# Altium schematic sheet LDO-LM1117.SchDoc: LDO Regulator
size A4; Address3: Self Checkout Shopping Cart; DocumentNumber: 1; Revision: 1.0; SheetNumber: 4; SheetTotal: 7
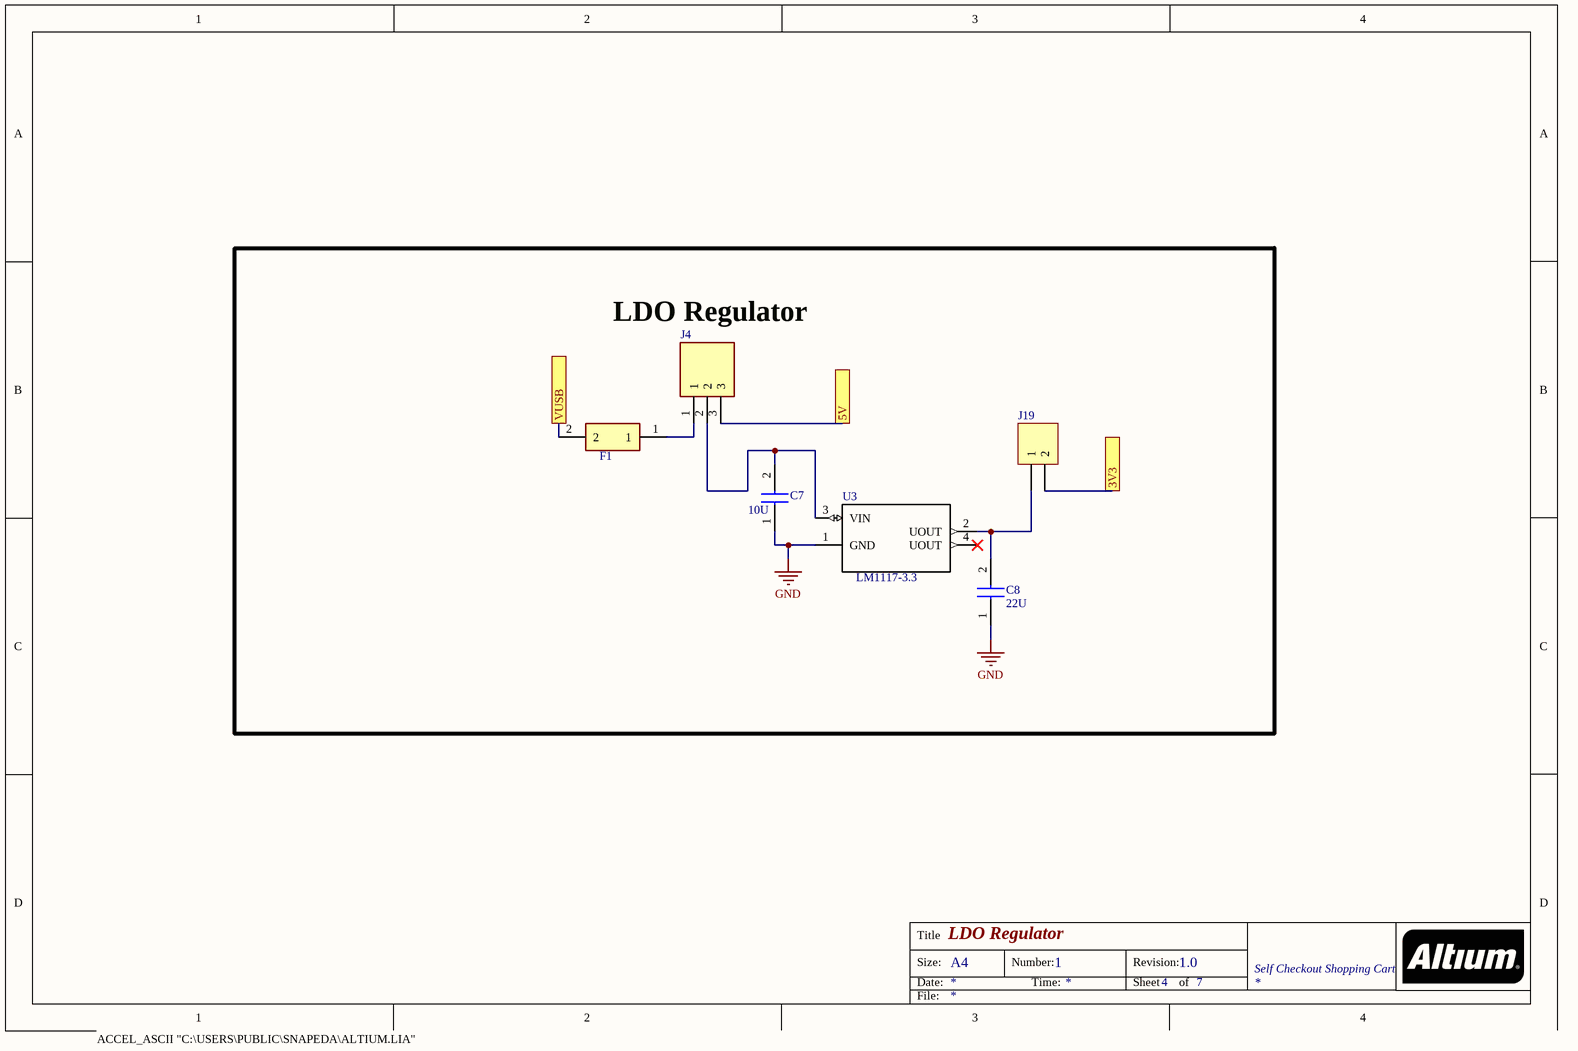
[diagram p0: LDO-LM1117.SchDoc]

## Parts
C7  value 10U  [CAPC6153X300N]  (hidden comment: KCM55LR71E156KH01K)
C8  value 22U  [CAPC3225X270N]  (hidden comment: GRM32ER71C226KEA8L)
F1  MF-MSMF050-2  [FUSC4632X85N]  (value not drawn)
J4  61900311121  [SHDR3W64P0X254_1X3_766X580X1175P]  (value not drawn)
J19  Header 2  [HDR1X2]  (value not drawn)
U3  LM1117-3.3  [*SOT-223]

## Blocks framed on the sheet
LDO Regulator: C7 C8 F1 J4 J19 U3

## Ports
3V3, 5V, VUSB

## Nets
GND: C7.1 C8.1 U3.1(GND)
3V3: J19.2 ; port 3V3
5V: J4.3 ; port 5V
VUSB: F1.2 ; port VUSB
NetC7_2: C7.2 J4.2 U3.3(VIN)
NetC8_2: C8.2 J19.1 U3.2(UOUT)
NetF1_1: F1.1 J4.1

Not connected (* = marked no-connect by the designer): U3 4(UOUT)*

## Notes on the sheet
- ACCEL_ASCII "C:\USERS\PUBLIC\SNAPEDA\ALTIUM.LIA"
  (asciiHeader
  (asciiVersion 5 0)
  (fileAuthor "(c) SnapEDA 2016 (snapeda.com)")
  (copyright "This work is licensed under a Creative Commons Attribution-ShareAlike 4.0 International License (CC BY-SA) with Design Exception 1.0")
  (fileUnits mm)
  )
  (library "Library"
  (padStyleDef "SSX45Y13"
  (holeDiam 0)
  (startRange 1)
  (endRange 2)
  (padShape (layerNumRef 1) (padShapeType Rect) (shapeWidth 0.45) (shapeHeight 1.38))
  (padShape (layerNumRef 2) (padShapeType Rect) (shapeWidth 0) (shapeHeight 0))
  (padShape (layerType Signal) (padShapeType Rect) (shapeWidth 0) (shapeHeight 0))
  (padShape (padShapeType Rect) (shapeWidth 0.45) (shapeHeight 1.38))
  (padShape (padShapeType Rect) (shapeWidth 0.45) (shapeHeight 1.38))
  (padShape (layerType Plane) (padShapeType NoConnect) (shapeWidth 0) (shapeHeight 0))
  (padShape (layerType NonSignal) (padShapeType Oval) (shapeWidth 0) (shapeHeight 0))
  )
  (padStyleDef "SSX14Y21"
  (holeDiam 0)
  (startRange 1)
  (endRange 2)
  (padShape (layerNumRef 1) (padShapeType Rect) (shapeWidth 1.4) (shapeHeight 2.1))
  (padShape (layerNumRef 2) (padShapeType Rect) (shapeWidth 0) (shapeHeight 0))
  (padShape (layerType Signal) (padShapeType Rect) (shapeWidth 0) (shapeHeight 0))
  (padShape (padShapeType Rect) (shapeWidth 1.4) (shapeHeight 2.1))
  (padShape (padShapeType Rect) (shapeWidth 1.4) (shapeHeight 2.1))
  (padShape (layerType Plane) (padShapeType NoConnect) (shapeWidth 0) (shapeHeight 0))
  (padShape (layerType NonSignal) (padShapeType Oval) (shapeWidth 0) (shapeHeight 0))
  )
  (padStyleDef "SSX13Y21"
  (holeDiam 0)
  (startRange 1)
  (endRange 2)
  (padShape (layerNumRef 1) (padShapeType Rect) (shapeWidth 1.375) (shapeHeight 2.1))
  (padShape (layerNumRef 2) (padShapeType Rect) (shapeWidth 0) (shapeHeight 0))
  (padShape (layerType Signal) (padShapeType Rect) (shapeWidth 0) (shapeHeight 0))
  (padShape (padShapeType Rect) (shapeWidth 1.375) (shapeHeight 2.1))
  (padShape (padShapeType Rect) (shapeWidth 1.375) (shapeHeight 2.1))
  (padShape (layerType Plane) (padShapeType NoConnect) (shapeWidth 0) (shapeHeight 0))
  (padShape (layerType NonSignal) (padShapeType Oval) (shapeWidth 0) (shapeHeight 0))
  )
  (padStyleDef "DUD60"
  (holeDiam 0.6)
  (isHolePlated False)
  (startRange 1)
  (endRange 2)
  (padShape (layerNumRef 1) (padShapeType Oval) (shapeWidth 0.6) (shapeHeight 0.6))
  (padShape (layerNumRef 2) (padShapeType Oval) (shapeWidth 0.6) (shapeHeight 0.6))
  (padShape (layerType Signal) (padShapeType Oval) (shapeWidth 0.6) (shapeHeight 0.6))
  (padShape (layerType Plane) (padShapeType NoConnect) (shapeWidth 0) (shapeHeight 0))
  (padShape (layerType NonSignal) (padShapeType Oval) (shapeWidth 0) (shapeHeight 0))
  )
  (padStyleDef "SSX10Y10"
  (holeDiam 0)
  (startRange 1)
  (endRange 2)
  (padShape (layerNumRef 1) (padShapeType Rect) (shapeWidth 0.1) (shapeHeight 0.1))
  (padShape (layerNumRef 2) (padShapeType Rect) (shapeWidth 0) (shapeHeight 0))
  (padShape (layerType Signal) (padShapeType Rect) (shapeWidth 0) (shapeHeight 0))
  (padShape (padShapeType Rect) (shapeWidth 0) (shapeHeight 0))
  (padShape (padShapeType Rect) (shapeWidth 0) (shapeHeight 0))
  (padShape (layerType Plane) (padShapeType NoConnect) (shapeWidth 0) (shapeHeight 0))
  (padShape (layerType NonSignal) (padShapeType Oval) (shapeWidth 0) (shapeHeight 0))
  )
  (textStyleDef "(Default)"
  (font
  (fontType Stroke)
  (fontFamily Modern)
  (fontFace "Quality")
  (fontHeight 3.54)
  )
  (textStyleAllowTType True)
  (textStyleDisplayTType False)
  )
  (textStyleDef "(PinStyle)"
  (font
  (fontType Stroke)
  (fontFamily SanSerif)
  (fontFace "QUALITY")
  (fontHeight 3.54)
  (strokeWidth 0.001)
  )
  (font
  (fontType TrueType)
  (fontFamily Modern)
  (fontFace "Times New Roman")
  (fontHeight 3.54)
  (strokeWidth 0.19843)
  (fontWeight 400)
  (fontCharSet 0)
  (fontOutPrecision 7)
  (fontClipPrecision 32)
  (fontQuality 1)
  (fontPitchAndFamily 6)
  )
  (textStyleAllowTType True)
  (textStyleDisplayTType False)
  )
  (textStyleDef "(LabelStyle)"
  (font
  (fontType Stroke)
  (fontFamily SanSerif)
  (fontFace "QUALITY")
  (fontHeight 3.54)
  (strokeWidth 0.001)
  )
  (font
  (fontType TrueType)
  (fontFamily Modern)
  (fontFace "Times New Roman")
  (fontHeight 3)
  (strokeWidth 0.19843)
  (fontWeight 400)
  (fontCharSet 0)
  (fontOutPrecision 7)
  (fontClipPrecision 32)
  (fontQuality 1)
  (fontPitchAndFamily 6)
  )
  (textStyleAllowTType True)
  (textStyleDisplayTType False)
  )
  (patternDefExtended "*TE_1932788-1"
  (originalName "*TE_1932788-1")
  (patternGraphicsNameRef "Primary")
  (patternGraphicsDef
  (patternGraphicsNameDef "Primary")
  (multiLayer
  (pad (padNum 3) (padStyleRef "SSX45Y13") (pt 0 0))
  (pad (padNum SH1) (padStyleRef "SSX14Y21") (pt -2.5 -0.36))
  (pad (padNum SH2) (padStyleRef "SSX14Y21") (pt 2.5 -0.36))
  (pad (padNum SH5) (padStyleRef "SSX13Y21") (pt -0.9375 -2.71))
  (pad (padNum 2) (padStyleRef "SSX45Y13") (pt -0.65 0))
  (pad (padNum 4) (padStyleRef "SSX45Y13") (pt 0.65 0))
  (pad (padNum 1) (padStyleRef "SSX45Y13") (pt -1.3 0))
  (pad (padNum 5) (padStyleRef "SSX45Y13") (pt 1.3 0))
  (pad (padNum SH4) (padStyleRef "SSX13Y21") (pt 0.9375 -2.71))
  (pad (padNum None) (padStyleRef "DUD60") (pt -3.95 -2.66))
  (pad (padNum None) (padStyleRef "DUD60") (pt 3.95 -2.66))
  (pad (padNum SH3) (padStyleRef "SSX10Y10") (pt 4 -3.5))
  (pad (padNum SH6) (padStyleRef "SSX10Y10") (pt -4 -3.5))
  )
  (layerContents (layerNumRef 1)
  (pcbPoly
  (pt 3.65 -2.66)
  (pt 3.65 -2.31)
  (pt 3.65 -2.30215)
  (pt 3.65082 -2.28646)
  (pt 3.65246 -2.27083)
  (pt 3.65492 -2.25531)
  (pt 3.65819 -2.23994)
  (pt 3.66226 -2.22477)
  (pt 3.66711 -2.20983)
  (pt 3.67274 -2.19516)
  (pt 3.67913 -2.1808)
  (pt 3.68626 -2.1668)
  (pt 3.69412 -2.1532)
  (pt 3.70268 -2.14002)
  (pt 3.71191 -2.12731)
  (pt 3.7218 -2.1151)
  (pt 3.73231 -2.10342)
  (pt 3.74342 -2.09231)
  (pt 3.7551 -2.0818)
  (pt 3.76731 -2.07191)
  (pt 3.78002 -2.06268)
  (pt 3.7932 -2.05412)
  (pt 3.8068 -2.04627)
  (pt 3.8208 -2.03913)
  (pt 3.83515 -2.03274)
  (pt 3.84982 -2.02711)
  (pt 3.86476 -2.02226)
  (pt 3.87994 -2.01819)
  (pt 3.89531 -2.01492)
  (pt 3.91083 -2.01246)
  (pt 3.92645 -2.01082)
  (pt 3.94214 -2.01)
  (pt 3.95 -2.01)
  (pt 3.95785 -2.01)
  (pt 3.97354 -2.01082)
  (pt 3.98917 -2.01246)
  (pt 4.00469 -2.01492)
  (pt 4.02006 -2.01819)
  (pt 4.03523 -2.02226)
  (pt 4.05017 -2.02711)
  (pt 4.06484 -2.03274)
  (pt 4.0792 -2.03913)
  (pt 4.0932 -2.04626)
  (pt 4.1068 -2.05412)
  (pt 4.11998 -2.06268)
  (pt 4.13269 -2.07191)
  (pt 4.1449 -2.0818)
  (pt 4.15658 -2.09231)
  (pt 4.16769 -2.10342)
  (pt 4.1782 -2.1151)
  (pt 4.18809 -2.12731)
  (pt 4.19732 -2.14002)
  (pt 4.20588 -2.1532)
  (pt 4.21373 -2.1668)
  (pt 4.22087 -2.1808)
  (pt 4.22726 -2.19515)
  (pt 4.23289 -2.20982)
  (pt 4.23774 -2.22476)
  (pt 4.24181 -2.23994)
  (pt 4.24508 -2.25531)
  (pt 4.24754 -2.27083)
  (pt 4.24918 -2.28645)
  (pt 4.25 -2.30214)
  (pt 4.25 -2.31)
  (pt 4.25 -3.01)
  (pt 4.25 -3.01785)
  (pt 4.24918 -3.03354)
  (pt 4.24754 -3.04917)
  (pt 4.24508 -3.06469)
  (pt 4.24181 -3.08006)
  (pt 4.23774 -3.09523)
  (pt 4.23289 -3.11017)
  (pt 4.22726 -3.12484)
  (pt 4.22087 -3.1392)
  (pt 4.21374 -3.1532)
  (pt 4.20588 -3.1668)
  (pt 4.19732 -3.17998)
  (pt 4.18809 -3.19269)
  (pt 4.1782 -3.2049)
  (pt 4.16769 -3.21658)
  (pt 4.15658 -3.22769)
  (pt 4.1449 -3.2382)
  (pt 4.13269 -3.24809)
  (pt 4.11998 -3.25732)
  (pt 4.1068 -3.26588)
  (pt 4.0932 -3.27373)
  (pt 4.0792 -3.28087)
  (pt 4.06485 -3.28726)
  (pt 4.05018 -3.29289)
  (pt 4.03524 -3.29774)
  (pt 4.02006 -3.30181)
  (pt 4.00469 -3.30508)
  (pt 3.98917 -3.30754)
  (pt 3.97355 -3.30918)
  (pt 3.95786 -3.31)
  (pt 3.95 -3.31)
  (pt 3.94215 -3.31)
  (pt 3.92646 -3.30918)
  (pt 3.91083 -3.30754)
  (pt 3.89531 -3.30508)
  (pt 3.87994 -3.30181)
  (pt 3.86477 -3.29774)
  (pt 3.84983 -3.29289)
  (pt 3.83516 -3.28726)
  (pt 3.8208 -3.28087)
  (pt 3.8068 -3.27374)
  (pt 3.7932 -3.26588)
  (pt 3.78002 -3.25732)
  (pt 3.76731 -3.24809)
  (pt 3.7551 -3.2382)
  (pt 3.74342 -3.22769)
  (pt 3.73231 -3.21658)
  (pt 3.7218 -3.2049)
  (pt 3.71191 -3.19269)
  (pt 3.70268 -3.17998)
  (pt 3.69412 -3.1668)
  (pt 3.68627 -3.1532)
  (pt 3.67913 -3.1392)
  (pt 3.67274 -3.12485)
  (pt 3.66711 -3.11018)
  (pt 3.66226 -3.09524)
  (pt 3.65819 -3.08006)
  (pt 3.65492 -3.06469)
  (pt 3.65246 -3.04917)
  (pt 3.65082 -3.03355)
  (pt 3.65 -3.01786)
  (pt 3.65 -3.01)
  (pt 3.65 -2.66)
  (pt 3.25 -2.66)
  (pt 3.25 -3.01)
  (pt 3.25 -3.02833)
  (pt 3.25192 -3.06494)
  (pt 3.25575 -3.1014)
  (pt 3.26148 -3.1376)
  (pt 3.26911 -3.17346)
  (pt 3.2786 -3.20887)
  (pt 3.28992 -3.24374)
  (pt 3.30306 -3.27797)
  (pt 3.31797 -3.31146)
  (pt 3.33462 -3.34412)
  (pt 3.35295 -3.37587)
  (pt 3.37291 -3.40662)
  (pt 3.39446 -3.43628)
  (pt 3.41753 -3.46477)
  (pt 3.44206 -3.49201)
  (pt 3.46798 -3.51793)
  (pt 3.49523 -3.54246)
  (pt 3.52372 -3.56554)
  (pt 3.55338 -3.58708)
  (pt 3.58412 -3.60705)
  (pt 3.61587 -3.62538)
  (pt 3.64854 -3.64202)
  (pt 3.68203 -3.65694)
  (pt 3.71625 -3.67007)
  (pt 3.75112 -3.6814)
  (pt 3.78653 -3.69089)
  (pt 3.82239 -3.69851)
  (pt 3.8586 -3.70425)
  (pt 3.89506 -3.70808)
  (pt 3.93167 -3.71)
  (pt 3.95 -3.71)
  (pt 3.96833 -3.71)
  (pt 4.00494 -3.70808)
  (pt 4.0414 -3.70425)
  (pt 4.0776 -3.69852)
  (pt 4.11346 -3.69089)
  (pt 4.14887 -3.6814)
  (pt 4.18374 -3.67008)
  (pt 4.21797 -3.65694)
  (pt 4.25146 -3.64203)
  (pt 4.28412 -3.62538)
  (pt 4.31587 -3.60705)
  (pt 4.34662 -3.58709)
  (pt 4.37628 -3.56554)
  (pt 4.40477 -3.54247)
  (pt 4.43201 -3.51794)
  (pt 4.45793 -3.49202)
  (pt 4.48246 -3.46477)
  (pt 4.50554 -3.43628)
  (pt 4.52708 -3.40662)
  (pt 4.54705 -3.37588)
  (pt 4.56538 -3.34413)
  (pt 4.58202 -3.31146)
  (pt 4.59694 -3.27797)
  (pt 4.61007 -3.24375)
  (pt 4.6214 -3.20888)
  (pt 4.63089 -3.17347)
  (pt 4.63851 -3.13761)
  (pt 4.64425 -3.1014)
  (pt 4.64808 -3.06494)
  (pt 4.65 -3.02833)
  (pt 4.65 -3.01)
  (pt 4.65 -2.31)
  (pt 4.65 -2.29167)
  (pt 4.64808 -2.25506)
  (pt 4.64425 -2.2186)
  (pt 4.63852 -2.1824)
  (pt 4.63089 -2.14654)
  (pt 4.6214 -2.11113)
  (pt 4.61008 -2.07626)
  (pt 4.59694 -2.04203)
  (pt 4.58203 -2.00854)
  (pt 4.56538 -1.97588)
  (pt 4.54705 -1.94413)
  (pt 4.52709 -1.91338)
  (pt 4.50554 -1.88372)
  (pt 4.48247 -1.85523)
  (pt 4.45794 -1.82799)
  (pt 4.43202 -1.80207)
  (pt 4.40477 -1.77754)
  (pt 4.37628 -1.75446)
  (pt 4.34662 -1.73292)
  (pt 4.31588 -1.71295)
  (pt 4.28413 -1.69462)
  (pt 4.25146 -1.67798)
  (pt 4.21797 -1.66306)
  (pt 4.18375 -1.64993)
  (pt 4.14888 -1.6386)
  (pt 4.11347 -1.62911)
  (pt 4.07761 -1.62149)
  (pt 4.0414 -1.61575)
  (pt 4.00494 -1.61192)
  (pt 3.96833 -1.61)
  (pt 3.95 -1.61)
  (pt 3.93167 -1.61)
  (pt 3.89506 -1.61192)
  (pt 3.8586 -1.61575)
  (pt 3.8224 -1.62148)
  (pt 3.78654 -1.62911)
  (pt 3.75113 -1.6386)
  (pt 3.71626 -1.64992)
  (pt 3.68203 -1.66306)
  (pt 3.64854 -1.67797)
  (pt 3.61588 -1.69462)
  (pt 3.58413 -1.71295)
  (pt 3.55338 -1.73291)
  (pt 3.52372 -1.75446)
  (pt 3.49523 -1.77753)
  (pt 3.46799 -1.80206)
  (pt 3.44207 -1.82798)
  (pt 3.41754 -1.85523)
  (pt 3.39446 -1.88372)
  (pt 3.37292 -1.91338)
  (pt 3.35295 -1.94412)
  (pt 3.33462 -1.97587)
  (pt 3.31798 -2.00854)
  (pt 3.30306 -2.04203)
  (pt 3.28993 -2.07625)
  (pt 3.2786 -2.11112)
  (pt 3.26911 -2.14653)
  (pt 3.26149 -2.18239)
  (pt 3.25575 -2.2186)
  (pt 3.25192 -2.25506)
  (pt 3.25 -2.29167)
  (pt 3.25 -2.31)
  (pt 3.25 -2.66)
  (pt 3.65 -2.66)
  )
  (pcbPoly
  (pt -4.25 -2.66)
  (pt -4.25 -2.31)
  (pt -4.25 -2.30215)
  (pt -4.24918 -2.28646)
  (pt -4.24754 -2.27083)
  (pt -4.24508 -2.25531)
  (pt -4.24181 -2.23994)
  (pt -4.23774 -2.22477)
  (pt -4.23289 -2.20983)
  (pt -4.22726 -2.19516)
  (pt -4.22087 -2.1808)
  (pt -4.21374 -2.1668)
  (pt -4.20588 -2.1532)
  (pt -4.19732 -2.14002)
  (pt -4.18809 -2.12731)
  (pt -4.1782 -2.1151)
  (pt -4.16769 -2.10342)
  (pt -4.15658 -2.09231)
  (pt -4.1449 -2.0818)
  (pt -4.13269 -2.07191)
  (pt -4.11998 -2.06268)
  (pt -4.1068 -2.05412)
  (pt -4.0932 -2.04627)
  (pt -4.0792 -2.03913)
  (pt -4.06485 -2.03274)
  (pt -4.05018 -2.02711)
  (pt -4.03524 -2.02226)
  (pt -4.02006 -2.01819)
  (pt -4.00469 -2.01492)
  (pt -3.98917 -2.01246)
  (pt -3.97355 -2.01082)
  (pt -3.95786 -2.01)
  (pt -3.95 -2.01)
  (pt -3.94215 -2.01)
  (pt -3.92646 -2.01082)
  (pt -3.91083 -2.01246)
  (pt -3.89531 -2.01492)
  (pt -3.87994 -2.01819)
  (pt -3.86477 -2.02226)
  (pt -3.84983 -2.02711)
  (pt -3.83516 -2.03274)
  (pt -3.8208 -2.03913)
  (pt -3.8068 -2.04626)
  (pt -3.7932 -2.05412)
  (pt -3.78002 -2.06268)
  (pt -3.76731 -2.07191)
  (pt -3.7551 -2.0818)
  (pt -3.74342 -2.09231)
  (pt -3.73231 -2.10342)
  (pt -3.7218 -2.1151)
  (pt -3.71191 -2.12731)
  (pt -3.70268 -2.14002)
  (pt -3.69412 -2.1532)
  (pt -3.68627 -2.1668)
  (pt -3.67913 -2.1808)
  (pt -3.67274 -2.19515)
  (pt -3.66711 -2.20982)
  (pt -3.66226 -2.22476)
  (pt -3.65819 -2.23994)
  (pt -3.65492 -2.25531)
  (pt -3.65246 -2.27083)
  (pt -3.65082 -2.28645)
  (pt -3.65 -2.30214)
  (pt -3.65 -2.31)
  (pt -3.65 -3.01)
  (pt -3.65 -3.01785)
  (pt -3.65082 -3.03354)
  (pt -3.65246 -3.04917)
  (pt -3.65492 -3.06469)
  (pt -3.65819 -3.08006)
  (pt -3.66226 -3.09523)
  (pt -3.66711 -3.11017)
  (pt -3.67274 -3.12484)
  (pt -3.67913 -3.1392)
  (pt -3.68626 -3.1532)
  (pt -3.69412 -3.1668)
  (pt -3.70268 -3.17998)
  (pt -3.71191 -3.19269)
  (pt -3.7218 -3.2049)
  (pt -3.73231 -3.21658)
  (pt -3.74342 -3.22769)
  (pt -3.7551 -3.2382)
  (pt -3.76731 -3.24809)
  (pt -3.78002 -3.25732)
  (pt -3.7932 -3.26588)
  (pt -3.8068 -3.27373)
  (pt -3.8208 -3.28087)
  (pt -3.83515 -3.28726)
  (pt -3.84982 -3.29289)
  (pt -3.86476 -3.29774)
  (pt -3.87994 -3.30181)
  (pt -3.89531 -3.30508)
  (pt -3.91083 -3.30754)
  (pt -3.92645 -3.30918)
  (pt -3.94214 -3.31)
  (pt -3.95 -3.31)
  (pt -3.95785 -3.31)
  (pt -3.97354 -3.30918)
  (pt -3.98917 -3.30754)
  (pt -4.00469 -3.30508)
  (pt -4.02006 -3.30181)
  (pt -4.03523 -3.29774)
  (pt -4.05017 -3.29289)
  (pt -4.06484 -3.28726)
  (pt -4.0792 -3.28087)
  (pt -4.0932 -3.27374)
  (pt -4.1068 -3.26588)
  (pt -4.11998 -3.25732)
  (pt -4.13269 -3.24809)
  (pt -4.1449 -3.2382)
  (pt -4.15658 -3.22769)
  (pt -4.16769 -3.21658)
  (pt -4.1782 -3.2049)
  (pt -4.18809 -3.19269)
  (pt -4.19732 -3.17998)
  (pt -4.20588 -3.1668)
  (pt -4.21373 -3.1532)
  (pt -4.22087 -3.1392)
  (pt -4.22726 -3.12485)
  (pt -4.23289 -3.11018)
  (pt -4.23774 -3.09524)
  (pt -4.24181 -3.08006)
  (pt -4.24508 -3.06469)
  (pt -4.24754 -3.04917)
  (pt -4.24918 -3.03355)
  (pt -4.25 -3.01786)
  (pt -4.25 -3.01)
  (pt -4.25 -2.66)
  (pt -4.65 -2.66)
  (pt -4.65 -3.01)
  (pt -4.65 -3.02833)
  (pt -4.64808 -3.06494)
  (pt -4.64425 -3.1014)
  (pt -4.63852 -3.1376)
  (pt -4.63089 -3.17346)
  (pt -4.6214 -3.20887)
  (pt -4.61008 -3.24374)
  (pt -4.59694 -3.27797)
  (pt -4.58203 -3.31146)
  (pt -4.56538 -3.34412)
  (pt -4.54705 -3.37587)
  (pt -4.52709 -3.40662)
  (pt -4.50554 -3.43628)
  (pt -4.48247 -3.46477)
  (pt -4.45794 -3.49201)
  (pt -4.43202 -3.51793)
  (pt -4.40477 -3.54246)
  (pt -4.37628 -3.56554)
  (pt -4.34662 -3.58708)
  (pt -4.31588 -3.60705)
  (pt -4.28413 -3.62538)
  (pt -4.25146 -3.64202)
  (pt -4.21797 -3.65694)
  (pt -4.18375 -3.67007)
  (pt -4.14888 -3.6814)
  (pt -4.11347 -3.69089)
  (pt -4.07761 -3.69851)
  (pt -4.0414 -3.70425)
  (pt -4.00494 -3.70808)
  (pt -3.96833 -3.71)
  (pt -3.95 -3.71)
  (pt -3.93167 -3.71)
  (pt -3.89506 -3.70808)
  (pt -3.8586 -3.70425)
  (pt -3.8224 -3.69852)
  (pt -3.78654 -3.69089)
  (pt -3.75113 -3.6814)
  (pt -3.71626 -3.67008)
  (pt -3.68203 -3.65694)
  (pt -3.64854 -3.64203)
  (pt -3.61588 -3.62538)
  (pt -3.58413 -3.60705)
  (pt -3.55338 -3.58709)
  (pt -3.52372 -3.56554)
  (pt -3.49523 -3.54247)
  (pt -3.46799 -3.51794)
  (pt -3.44207 -3.49202)
  (pt -3.41754 -3.46477)
  (pt -3.39446 -3.43628)
  (pt -3.37292 -3.40662)
  (pt -3.35295 -3.37588)
  (pt -3.33462 -3.34413)
  (pt -3.31798 -3.31146)
  (pt -3.30306 -3.27797)
  (pt -3.28993 -3.24375)
  (pt -3.2786 -3.20888)
  (pt -3.26911 -3.17347)
  (pt -3.26149 -3.13761)
  (pt -3.25575 -3.1014)
  (pt -3.25192 -3.06494)
  (pt -3.25 -3.02833)
  (pt -3.25 -3.01)
  (pt -3.25 -2.31)
  (pt -3.25 -2.29167)
  (pt -3.25192 -2.25506)
  (pt -3.25575 -2.2186)
  (pt -3.26148 -2.1824)
  (pt -3.26911 -2.14654)
  (pt -3.2786 -2.11113)
  (pt -3.28992 -2.07626)
  (pt -3.30306 -2.04203)
  (pt -3.31797 -2.00854)
  (pt -3.33462 -1.97588)
  (pt -3.35295 -1.94413)
  (pt -3.37291 -1.91338)
  (pt -3.39446 -1.88372)
  (pt -3.41753 -1.85523)
  (pt -3.44206 -1.82799)
  (pt -3.46798 -1.80207)
  (pt -3.49523 -1.77754)
  (pt -3.52372 -1.75446)
  (pt -3.55338 -1.73292)
  (pt -3.58412 -1.71295)
  (pt -3.61587 -1.69462)
  (pt -3.64854 -1.67798)
  (pt -3.68203 -1.66306)
  (pt -3.71625 -1.64993)
  (pt -3.75112 -1.6386)
  (pt -3.78653 -1.62911)
  (pt -3.82239 -1.62149)
  (pt -3.8586 -1.61575)
  (pt -3.89506 -1.61192)
  (pt -3.93167 -1.61)
  (pt -3.95 -1.61)
  (pt -3.96833 -1.61)
  (pt -4.00494 -1.61192)
  (pt -4.0414 -1.61575)
  (pt -4.0776 -1.62148)
  (pt -4.11346 -1.62911)
  (pt -4.14887 -1.6386)
  (pt -4.18374 -1.64992)
  (pt -4.21797 -1.66306)
  (pt -4.25146 -1.67797)
  (pt -4.28412 -1.69462)
  (pt -4.31587 -1.71295)
  (pt -4.34662 -1.73291)
  (pt -4.37628 -1.75446)
  (pt -4.40477 -1.77753)
  (pt -4.43201 -1.80206)
  (pt -4.45793 -1.82798)
  (pt -4.48246 -1.85523)
  (pt -4.50554 -1.88372)
  (pt -4.52708 -1.91338)
  (pt -4.54705 -1.94412)
  (pt -4.56538 -1.97587)
  (pt -4.58202 -2.00854)
  (pt -4.59694 -2.04203)
  (pt -4.61007 -2.07625)
  (pt -4.6214 -2.11112)
  (pt -4.63089 -2.14653)
  (pt -4.63851 -2.18239)
  (pt -4.64425 -2.2186)
  (pt -4.64808 -2.25506)
  (pt -4.65 -2.29167)
  (pt -4.65 -2.31)
  (pt -4.65 -2.66)
  (pt -4.25 -2.66)
  )
  )
  (layerContents (layerNumRef 20)
  (line (pt -3.76 0.34) (pt 3.76 0.34) (width 0.127))
  (line (pt 3.76 0.34) (pt 3.76 -4.11) (width 0.127))
  (line (pt 3.76 -4.11) (pt 3.76 -4.81) (width 0.127))
  (line (pt 3.76 -4.81) (pt -3.76 -4.81) (width 0.127))
  (line (pt -3.76 -4.81) (pt -3.76 -4.11) (width 0.127))
  (line (pt -3.76 -4.11) (pt -3.76 0.34) (width 0.127))
  (attr "RefDes" "" (pt -5.00279 1.59089) (justify LowerLeft) (isVisible True) (textStyleRef "(PinStyle)"))
  (attr "Type" "" (pt -5.30911 -6.81169) (justify LowerLeft) (isVisible True) (textStyleRef "(PinStyle)"))
  (text (pt 0.490973 -4.32808) "PCB EDGE" (justify LowerLeft) (isVisible True) (textStyleRef "(LabelStyle)"))
  (line (pt -3.76 -4.11) (pt 3.76 -4.11) (width 0.127))
  (arc (pt -1.3 0) (radius 0.1) (startAngle 0) (sweepAngle 360) (width 0.2))
  )
  (layerContents (layerNumRef 20)
  (line (pt -3.76 0.34) (pt 3.76 0.34) (width 0.127))
  (line (pt 3.76 0.34) (pt 3.76 -4.11) (width 0.127))
  (line (pt 3.76 -4.11) (pt 3.76 -4.81) (width 0.127))
  (line (pt 3.76 -4.81) (pt -3.76 -4.81) (width 0.127))
  (line (pt -3.76 -4.81) (pt -3.76 -4.11) (width 0.127))
  (line (pt -3.76 -4.11) (pt -3.76 0.34) (width 0.127))
  (attr "RefDes" "" (pt -5.00279 1.59089) (justify LowerLeft) (isVisible True) (textStyleRef "(PinStyle)"))
  (attr "Type" "" (pt -5.30911 -6.81169) (justify LowerLeft) (isVisible True) (textStyleRef "(PinStyle)"))
  (text (pt 0.490973 -4.32808) "PCB EDGE" (justify LowerLeft) (isVisible True) (textStyleRef "(LabelStyle)"))
  (line (pt -3.76 -4.11) (pt 3.76 -4.11) (width 0.127))
  (arc (pt -1.3 0) (radius 0.1) (startAngle 0) (sweepAngle 360) (width 0.2))
  )
  (layerContents (layerNumRef 10)
  (line (pt -4.7 -4.11) (pt -3.3 -4.11) (width 0.0001))
  (line (pt -3.3 -4.11) (pt -2.825 -3.61) (width 0.0001))
  (line (pt -2.825 -3.61) (pt -2.825 -2.51) (width 0.0001))
  (arc (pt -2.3875 -2.4975) (radius 0.437679) (startAngle 92) (sweepAngle 90) (width 0.0001))
  (arc (pt -2.3875 -2.5225) (radius 0.462669) (startAngle 2) (sweepAngle 90) (width 0.0001))
  (line (pt -1.925 -2.51) (pt -1.925 -3.61) (width 0.0001))
  (line (pt -1.925 -3.61) (pt -1.5 -4.11) (width 0.0001))
  (line (pt -1.5 -4.11) (pt 1.5 -4.11) (width 0.0001))
  (line (pt 1.5 -4.11) (pt 1.925 -3.61) (width 0.0001))
  (line (pt 1.925 -3.61) (pt 1.925 -2.51) (width 0.0001))
  (arc (pt 2.3875 -2.5225) (radius 0.462669) (startAngle 88) (sweepAngle 90) (width 0.0001))
  (arc (pt 2.3875 -2.4975) (radius 0.437679) (startAngle 358) (sweepAngle -270) (width 0.0001))
  (line (pt 2.825 -2.51) (pt 2.825 -3.61) (width 0.0001))
  (line (pt 2.825 -3.61) (pt 3.3 -4.11) (width 0.0001))
  (line (pt 3.3 -4.11) (pt 4.9 -4.11) (width 0.0001))
  (arc (pt 3.95 -2.31) (radius 0.3) (startAngle 0) (sweepAngle 90) (width 0.0001))
  (arc (pt 3.95 -2.31) (radius 0.3) (startAngle 90) (sweepAngle 90) (width 0.0001))
  (line (pt 3.65 -2.31) (pt 3.65 -3.01) (width 0.0001))
  (arc (pt 3.95 -3.01) (radius 0.3) (startAngle 180) (sweepAngle 90) (width 0.0001))
  (arc (pt 3.95 -3.01) (radius 0.3) (startAngle 270) (sweepAngle -270) (width 0.0001))
  (line (pt 4.25 -3.01) (pt 4.25 -2.31) (width 0.0001))
  (arc (pt -3.95 -2.31) (radius 0.3) (startAngle 0) (sweepAngle 90) (width 0.0001))
  (arc (pt -3.95 -2.31) (radius 0.3) (startAngle 90) (sweepAngle 90) (width 0.0001))
  (line (pt -4.25 -2.31) (pt -4.25 -3.01) (width 0.0001))
  (arc (pt -3.95 -3.01) (radius 0.3) (startAngle 180) (sweepAngle 90) (width 0.0001))
  (arc (pt -3.95 -3.01) (radius 0.3) (startAngle 270) (sweepAngle -270) (width 0.0001))
  (line (pt -3.65 -3.01) (pt -3.65 -2.31) (width 0.0001))
  )
  (layerContents (layerNumRef 6)
  (line (pt -3.76 -3.96) (pt -3.76 -4.81) (width 0.127))
  (line (pt -3.76 -4.81) (pt 3.76 -4.81) (width 0.127))
  (line (pt 3.76 -4.81) (pt 3.76 -3.96) (width 0.127))
  (line (pt -3.76 -1.36) (pt -3.76 0.34) (width 0.127))
  (line (pt -3.76 0.34) (pt -3.4 0.34) (width 0.127))
  (line (pt 3.4 0.34) (pt 3.76 0.34) (width 0.127))
  (line (pt 3.76 0.34) (pt 3.76 -1.36) (width 0.127))
  (arc (pt -1.3 1.25) (radius 0.1) (startAngle 0) (sweepAngle 360) (width 0.2))
  )
  (layerContents (layerNumRef 5)
  (pcbPoly
  (pt 3.65 -2.66)
  (pt 3.65 -2.31)
  (pt 3.65 -2.30215)
  (pt 3.65082 -2.28646)
  (pt 3.65246 -2.27083)
  (pt 3.65492 -2.25531)
  (pt 3.65819 -2.23994)
  (pt 3.66226 -2.22477)
  (pt 3.66711 -2.20983)
  (pt 3.67274 -2.19516)
  (pt 3.67913 -2.1808)
  (pt 3.68626 -2.1668)
  (pt 3.69412 -2.1532)
  (pt 3.70268 -2.14002)
  (pt 3.71191 -2.12731)
  (pt 3.7218 -2.1151)
  (pt 3.73231 -2.10342)
  (pt 3.74342 -2.09231)
  (pt 3.7551 -2.0818)
  (pt 3.76731 -2.07191)
  (pt 3.78002 -2.06268)
  (pt 3.7932 -2.05412)
  (pt 3.8068 -2.04627)
  (pt 3.8208 -2.03913)
  (pt 3.83515 -2.03274)
  (pt 3.84982 -2.02711)
  (pt 3.86476 -2.02226)
  (pt 3.87994 -2.01819)
  (pt 3.89531 -2.01492)
  (pt 3.91083 -2.01246)
  (pt 3.92645 -2.01082)
  (pt 3.94214 -2.01)
  (pt 3.95 -2.01)
  (pt 3.95785 -2.01)
  (pt 3.97354 -2.01082)
  (pt 3.98917 -2.01246)
  (pt 4.00469 -2.01492)
  (pt 4.02006 -2.01819)
  (pt 4.03523 -2.02226)
  (pt 4.05017 -2.02711)
  (pt 4.06484 -2.03274)
  (pt 4.0792 -2.03913)
  (pt 4.0932 -2.04626)
  (pt 4.1068 -2.05412)
  (pt 4.11998 -2.06268)
  (pt 4.13269 -2.07191)
  (pt 4.1449 -2.0818)
  (pt 4.15658 -2.09231)
  (pt 4.16769 -2.10342)
  (pt 4.1782 -2.1151)
  (pt 4.18809 -2.12731)
  (pt 4.19732 -2.14002)
  (pt 4.20588 -2.1532)
  (pt 4.21373 -2.1668)
  (pt 4.22087 -2.1808)
  (pt 4.22726 -2.19515)
  (pt 4.23289 -2.20982)
  (pt 4.23774 -2.22476)
  (pt 4.24181 -2.23994)
  (pt 4.24508 -2.25531)
  (pt 4.24754 -2.27083)
  (pt 4.24918 -2.28645)
  (pt 4.25 -2.30214)
  (pt 4.25 -2.31)
  (pt 4.25 -3.01)
  (pt 4.25 -3.01785)
  (pt 4.24918 -3.03354)
  (pt 4.24754 -3.04917)
  (pt 4.24508 -3.06469)
  (pt 4.24181 -3.08006)
  (pt 4.23774 -3.09523)
  (pt 4.23289 -3.11017)
  (pt 4.22726 -3.12484)
  (pt 4.22087 -3.1392)
  (pt 4.21374 -3.1532)
  (pt 4.20588 -3.1668)
  (pt 4.19732 -3.17998)
  (pt 4.18809 -3.19269)
  (pt 4.1782 -3.2049)
  (pt 4.16769 -3.21658)
  (pt 4.15658 -3.22769)
  (pt 4.1449 -3.2382)
  (pt 4.13269 -3.24809)
  (pt 4.11998 -3.25732)
  (pt 4.1068 -3.26588)
  (pt 4.0932 -3.27373)
  (pt 4.0792 -3.28087)
  (pt 4.06485 -3.28726)
  (pt 4.05018 -3.29289)
  (pt 4.03524 -3.29774)
  (pt 4.02006 -3.30181)
  (pt 4.00469 -3.30508)
  (pt 3.98917 -3.30754)
  (pt 3.97355 -3.30918)
  (pt 3.95786 -3.31)
  (pt 3.95 -3.31)
  (pt 3.94215 -3.31)
  (pt 3.92646 -3.30918)
  (pt 3.91083 -3.30754)
  (pt 3.89531 -3.30508)
  (pt 3.87994 -3.30181)
  (pt 3.86477 -3.29774)
  (pt 3.84983 -3.29289)
  (pt 3.83516 -3.28726)
  (pt 3.8208 -3.28087)
  (pt 3.8068 -3.27374)
  (pt 3.7932 -3.26588)
  (pt 3.78002 -3.25732)
  (pt 3.76731 -3.24809)
  (pt 3.7551 -3.2382)
  (pt 3.74342 -3.22769)
  (pt 3.73231 -3.21658)
  (pt 3.7218 -3.2049)
  (pt 3.71191 -3.19269)
  (pt 3.70268 -3.17998)
  (pt 3.69412 -3.1668)
  (pt 3.68627 -3.1532)
  (pt 3.67913 -3.1392)
  (pt 3.67274 -3.12485)
  (pt 3.66711 -3.11018)
  (pt 3.66226 -3.09524)
  (pt 3.65819 -3.08006)
  (pt 3.65492 -3.06469)
  (pt 3.65246 -3.04917)
  (pt 3.65082 -3.03355)
  (pt 3.65 -3.01786)
  (pt 3.65 -3.01)
  (pt 3.65 -2.66)
  (pt 3.25 -2.66)
  (pt 3.25 -3.01)
  (pt 3.25 -3.02833)
  (pt 3.25192 -3.06494)
  (pt 3.25575 -3.1014)
  (pt 3.26148 -3.1376)
  (pt 3.26911 -3.17346)
  (pt 3.2786 -3.20887)
  (pt 3.28992 -3.24374)
  (pt 3.30306 -3.27797)
  (pt 3.31797 -3.31146)
  (pt 3.33462 -3.34412)
  (pt
- Title
- Size:
- Date:
- A4
- Number:
- Time:
- Revision:
- Sheet
- of
- File:

## Library data of the parts
C7 = KCM55LR71E156KH01K: Capacitor; Manufacturer_Name: Murata Electronics; Datasheet Link: https://psearch.en.murata.com/capacitor/product/KCM55LR71E156KH01%23.html; Height: 3mm; Manufacturer_Part_Number: KCM55LR71E156KH01K; Mouser Part Number: 81-KCM55LR71E156KH1K; Mouser Price/Stock: https://www.mouser.com/ProductDetail/Murata-Electronics/KCM55LR71E156KH01K?qs=%2Fha2pyFadujTVicYMwxGf6al2IEnlbtrqh1JmJOdYSsKFh9aAuQRmXZk846chQr1
C8 = GRM32ER71C226KEA8L: Capacitor; Manufacturer_Name: Murata Electronics; Datasheet Link: http://psearch.en.murata.com/capacitor/product/GRM32ER71E226KE15%23.pdf; Height: 2.7mm; Manufacturer_Part_Number: GRM32ER71C226KEA8L; Mouser Part Number: 81-GRM32ER71C226KEAL; Mouser Price/Stock: https://www.mouser.com/Search/Refine.aspx?Keyword=81-GRM32ER71C226KEAL
F1 = MF-MSMF050-2: Fuse; Manufacturer_Name: Bourns; Allied_Number: 70153466; Datasheet Link: https://www.bourns.com/pdfs/mfmsmf.pdf; Height: 0.85mm; Manufacturer_Part_Number: MF-MSMF050-2; Mouser Part Number: 652-MF-MSMF050-2; Mouser Price/Stock: https://www.mouser.com/Search/Refine.aspx?Keyword=652-MF-MSMF050-2; RS Part Number: 6478156P; RS Price/Stock: http://uk.rs-online.com/web/p/products/6478156P; Allied Price/Stock: https://www.alliedelec.com/bourns-mf-msmf050-2/70153466/
J4 = 61900311121: Connector; Manufacturer_Name: Wurth Elektronik; Datasheet Link: https://katalog.we-online.de/em/datasheet/61900311121.pdf; Height: 11.75mm; Manufacturer_Part_Number: 61900311121; Mouser Part Number: 710-61900311121; Mouser Price/Stock: https://www.mouser.com/Search/Refine.aspx?Keyword=710-61900311121; RS Part Number: 8281474P; RS Price/Stock: http://uk.rs-online.com/web/p/products/8281474P
J19 = Header 2: Header, 2-Pin; Manufacturer_Part_Number: BG301-04-A-0540-L-B; Manufacturer_Name: Global Connector Technology; Digi-Key Part Number: 2073-BG301-02-A-0540-L-BCT-ND; Value: *; Digikey Price/Stock: https://www.digikey.com/product-detail/en/gct/BG301-04-A-0540-L-B/2073-BG301-04-A-0540-L-BCT-ND/9859670?utm_source=snapeda&utm_medium=aggregator&utm_campaign=symbol
U3 = LM1117-3.3: 3V3 Low Dropout Regulator; Manufacturer_Part_Number: LM1117MPX-3.3/NOPB; Manufacturer_Name: Texas Instruments; Package: SOT-223-4 Texas Instruments; Price: None; Value: *; Mouser Price/Stock: https://www.mouser.com/ProductDetail/Texas-Instruments/LM1117MPX-33-NOPB?qs=X1J7HmVL2ZHRbBIxXi4utg%3D%3D; Mouser Part Number: 926-LM1117MPX3.3NOPB; Datasheet Link: http://www.ti.com/lit/ds/symlink/lm1117.pdf